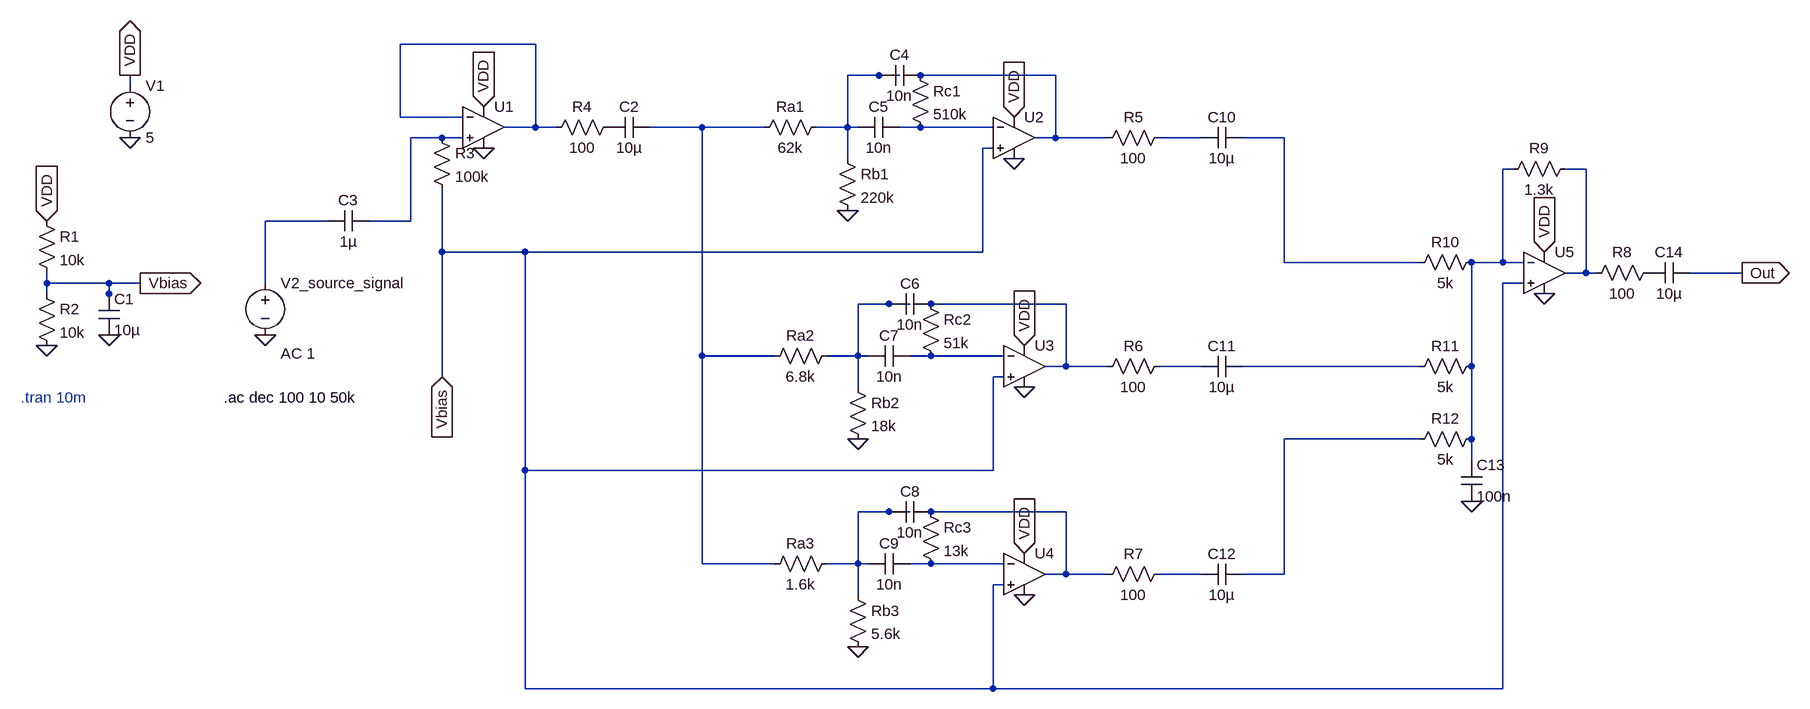
[diagram p0: schematic combined[1].asc]
combined[1].asc, the LTspice schematic file:
Version 4
SHEET 1 2308 1016
WIRE 352 16 144 16
WIRE 880 64 832 64
WIRE 912 64 880 64
WIRE 1152 64 944 64
WIRE -272 80 -272 64
WIRE 144 128 144 16
WIRE 240 128 144 128
WIRE 352 144 352 16
WIRE 352 144 304 144
WIRE 384 144 352 144
WIRE 608 144 528 144
WIRE 704 144 608 144
WIRE 832 144 832 64
WIRE 832 144 784 144
WIRE 848 144 832 144
WIRE 944 144 912 144
WIRE 1056 144 944 144
WIRE 208 160 160 160
WIRE 240 160 208 160
WIRE 1152 160 1152 64
WIRE 1152 160 1120 160
WIRE 1232 160 1152 160
WIRE 1376 160 1312 160
WIRE 1504 160 1440 160
WIRE 1056 176 1040 176
WIRE 832 192 832 144
WIRE 1856 208 1840 208
WIRE 1968 208 1936 208
WIRE 32 288 -64 288
WIRE 160 288 160 160
WIRE 160 288 96 288
WIRE 208 336 208 240
WIRE 336 336 208 336
WIRE 1040 336 1040 176
WIRE 1040 336 336 336
WIRE 1504 352 1504 160
WIRE 1712 352 1504 352
WIRE 1840 352 1840 208
WIRE 1840 352 1792 352
WIRE 1872 352 1840 352
WIRE 1968 368 1968 208
WIRE 1968 368 1936 368
WIRE 1984 368 1968 368
WIRE 2208 368 2128 368
WIRE -400 384 -400 368
WIRE -304 384 -400 384
WIRE -256 384 -304 384
WIRE -64 384 -64 288
WIRE 1872 384 1840 384
WIRE -400 400 -400 384
WIRE -304 400 -304 384
WIRE -304 416 -304 400
WIRE 896 416 848 416
WIRE 928 416 896 416
WIRE 1168 416 960 416
WIRE 608 496 608 144
WIRE 720 496 608 496
WIRE 848 496 848 416
WIRE 848 496 800 496
WIRE 864 496 848 496
WIRE 960 496 928 496
WIRE 1072 496 960 496
WIRE 1168 512 1168 416
WIRE 1168 512 1136 512
WIRE 1232 512 1168 512
WIRE 1376 512 1312 512
WIRE 1712 512 1440 512
WIRE 1792 512 1792 352
WIRE 208 528 208 336
WIRE 1072 528 1056 528
WIRE 848 544 848 496
WIRE 1712 624 1504 624
WIRE 1792 624 1792 512
WIRE 1792 656 1792 624
WIRE 336 672 336 336
WIRE 1056 672 1056 528
WIRE 1056 672 336 672
WIRE 896 736 848 736
WIRE 928 736 896 736
WIRE 1168 736 960 736
WIRE 608 816 608 496
WIRE 720 816 608 816
WIRE 848 816 848 736
WIRE 848 816 800 816
WIRE 864 816 848 816
WIRE 960 816 928 816
WIRE 1072 816 960 816
WIRE 1168 832 1168 736
WIRE 1168 832 1136 832
WIRE 1232 832 1168 832
WIRE 1376 832 1312 832
WIRE 1504 832 1504 624
WIRE 1504 832 1440 832
WIRE 1072 848 1056 848
WIRE 848 864 848 816
WIRE 336 1008 336 672
WIRE 1056 1008 1056 848
WIRE 1056 1008 336 1008
WIRE 1840 1008 1840 384
WIRE 1840 1008 1056 1008
FLAG -272 160 0
FLAG -272 64 VDD
IOPIN -272 64 Out
FLAG -400 480 0
FLAG -400 288 VDD
IOPIN -400 288 In
FLAG 272 112 VDD
IOPIN 272 112 In
FLAG 272 176 0
FLAG -304 464 0
FLAG -256 384 Vbias
IOPIN -256 384 Out
FLAG -64 464 0
FLAG 208 528 Vbias
IOPIN 208 528 In
FLAG 832 272 0
FLAG 1088 192 0
FLAG 1088 128 VDD
IOPIN 1088 128 In
FLAG 848 624 0
FLAG 1104 544 0
FLAG 1104 480 VDD
IOPIN 1104 480 In
FLAG 848 944 0
FLAG 1104 864 0
FLAG 1104 800 VDD
IOPIN 1104 800 In
FLAG 1792 720 0
FLAG 1904 400 0
FLAG 1904 336 VDD
IOPIN 1904 336 In
FLAG 2208 368 Out
IOPIN 2208 368 Out
SYMBOL OpAmps\\UniversalOpAmp 272 144 R0
SYMATTR InstName U1
SYMBOL voltage -272 64 R0
SYMATTR InstName V1
SYMATTR Value 5
SYMBOL res -416 272 R0
SYMATTR InstName R1
SYMATTR Value 10k
SYMBOL res -416 384 R0
SYMATTR InstName R2
SYMATTR Value 10k
SYMBOL cap -320 400 R0
SYMATTR InstName C1
SYMATTR Value 10µ
SYMBOL voltage -64 368 R0
WINDOW 123 24 124 Left 2
WINDOW 39 0 0 Left 0
SYMATTR Value2 AC 1
SYMATTR InstName V2_source_signal
SYMATTR Value ""
SYMBOL cap 96 272 R90
WINDOW 0 0 32 VBottom 2
WINDOW 3 32 32 VTop 2
SYMATTR InstName C3
SYMATTR Value 1µ
SYMBOL res 192 144 R0
SYMATTR InstName R3
SYMATTR Value 100k
SYMBOL res 480 128 R90
WINDOW 0 0 56 VBottom 2
WINDOW 3 32 56 VTop 2
SYMATTR InstName R4
SYMATTR Value 100
SYMBOL cap 528 128 R90
WINDOW 0 0 32 VBottom 2
WINDOW 3 32 32 VTop 2
SYMATTR InstName C2
SYMATTR Value 10µ
SYMBOL OpAmps\\UniversalOpAmp 1088 160 R0
SYMATTR InstName U2
SYMBOL cap 944 48 R90
WINDOW 0 0 32 VBottom 2
WINDOW 3 32 32 VTop 2
SYMATTR InstName C4
SYMATTR Value 10n
SYMBOL cap 912 128 R90
WINDOW 0 0 32 VBottom 2
WINDOW 3 32 32 VTop 2
SYMATTR InstName C5
SYMATTR Value 10n
SYMBOL res 928 48 R0
SYMATTR InstName Rc1
SYMATTR Value 510k
SYMBOL res 816 176 R0
SYMATTR InstName Rb1
SYMATTR Value 220k
SYMBOL res 800 128 R90
WINDOW 0 0 56 VBottom 2
WINDOW 3 32 56 VTop 2
SYMATTR InstName Ra1
SYMATTR Value 62k
SYMBOL OpAmps\\UniversalOpAmp 1104 512 R0
SYMATTR InstName U3
SYMBOL cap 960 400 R90
WINDOW 0 0 32 VBottom 2
WINDOW 3 32 32 VTop 2
SYMATTR InstName C6
SYMATTR Value 10n
SYMBOL cap 928 480 R90
WINDOW 0 0 32 VBottom 2
WINDOW 3 32 32 VTop 2
SYMATTR InstName C7
SYMATTR Value 10n
SYMBOL res 944 400 R0
SYMATTR InstName Rc2
SYMATTR Value 51k
SYMBOL res 832 528 R0
SYMATTR InstName Rb2
SYMATTR Value 18k
SYMBOL res 816 480 R90
WINDOW 0 0 56 VBottom 2
WINDOW 3 32 56 VTop 2
SYMATTR InstName Ra2
SYMATTR Value 6.8k
SYMBOL OpAmps\\UniversalOpAmp 1104 832 R0
SYMATTR InstName U4
SYMBOL cap 960 720 R90
WINDOW 0 0 32 VBottom 2
WINDOW 3 32 32 VTop 2
SYMATTR InstName C8
SYMATTR Value 10n
SYMBOL cap 928 800 R90
WINDOW 0 0 32 VBottom 2
WINDOW 3 32 32 VTop 2
SYMATTR InstName C9
SYMATTR Value 10n
SYMBOL res 944 720 R0
SYMATTR InstName Rc3
SYMATTR Value 13k
SYMBOL res 832 848 R0
SYMATTR InstName Rb3
SYMATTR Value 5.6k
SYMBOL res 816 800 R90
WINDOW 0 0 56 VBottom 2
WINDOW 3 32 56 VTop 2
SYMATTR InstName Ra3
SYMATTR Value 1.6k
SYMBOL res 1328 144 R90
WINDOW 0 0 56 VBottom 2
WINDOW 3 32 56 VTop 2
SYMATTR InstName R5
SYMATTR Value 100
SYMBOL res 1328 496 R90
WINDOW 0 0 56 VBottom 2
WINDOW 3 32 56 VTop 2
SYMATTR InstName R6
SYMATTR Value 100
SYMBOL res 1328 816 R90
WINDOW 0 0 56 VBottom 2
WINDOW 3 32 56 VTop 2
SYMATTR InstName R7
SYMATTR Value 100
SYMBOL cap 1440 144 R90
WINDOW 0 0 32 VBottom 2
WINDOW 3 32 32 VTop 2
SYMATTR InstName C10
SYMATTR Value 10µ
SYMBOL cap 1440 496 R90
WINDOW 0 0 32 VBottom 2
WINDOW 3 32 32 VTop 2
SYMATTR InstName C11
SYMATTR Value 10µ
SYMBOL cap 1440 816 R90
WINDOW 0 0 32 VBottom 2
WINDOW 3 32 32 VTop 2
SYMATTR InstName C12
SYMATTR Value 10µ
SYMBOL res 2080 352 R90
WINDOW 0 0 56 VBottom 2
WINDOW 3 32 56 VTop 2
SYMATTR InstName R8
SYMATTR Value 100
SYMBOL res 1952 192 R90
WINDOW 0 0 56 VBottom 2
WINDOW 3 32 56 VTop 2
SYMATTR InstName R9
SYMATTR Value 1.3k
SYMBOL cap 1776 656 R0
SYMATTR InstName C13
SYMATTR Value 100n
SYMBOL res 1808 336 R90
WINDOW 0 0 56 VBottom 2
WINDOW 3 32 56 VTop 2
SYMATTR InstName R10
SYMATTR Value 5k
SYMBOL res 1808 496 R90
WINDOW 0 0 56 VBottom 2
WINDOW 3 32 56 VTop 2
SYMATTR InstName R11
SYMATTR Value 5k
SYMBOL res 1808 608 R90
WINDOW 0 0 56 VBottom 2
WINDOW 3 32 56 VTop 2
SYMATTR InstName R12
SYMATTR Value 5k
SYMBOL cap 2128 352 R90
WINDOW 0 0 32 VBottom 2
WINDOW 3 32 32 VTop 2
SYMATTR InstName C14
SYMATTR Value 10µ
SYMBOL OpAmps\\UniversalOpAmp 1904 368 R0
SYMATTR InstName U5
TEXT -440 560 Left 2 ;.tran 10m
TEXT -128 560 Left 2 !.ac dec 100 10 50k

The netlist it stands for:
* combined[1].asc
XU1 N006 N001 VDD 0 N001 level1 Avol=1Meg GBW=10Meg Vos=0 En=0 Enk=0 In=0 Ink=0 Rin=500Meg  ; pins In+ In- V+ V- OUT
V1 VDD 0 5
R1 VDD Vbias 10k
R2 Vbias 0 10k
C1 Vbias 0 10µ
V2_source_signal N011 0 AC 1
C3 N006 N011 1µ
R3 N006 Vbias 100k
R4 P001 N001 100
C2 N004 P001 10µ
XU2 Vbias N005 VDD 0 N003 level1 Avol=1Meg GBW=10Meg Vos=0 En=0 Enk=0 In=0 Ink=0 Rin=500Meg  ; pins In+ In- V+ V- OUT
C4 N003 N002 10n
C5 N005 N002 10n
Rc1 N003 N005 510k
Rb1 N002 0 220k
Ra1 N002 N004 62k
XU3 Vbias N014 VDD 0 N013 level1 Avol=1Meg GBW=10Meg Vos=0 En=0 Enk=0 In=0 Ink=0 Rin=500Meg  ; pins In+ In- V+ V- OUT
C6 N013 N012 10n
C7 N014 N012 10n
Rc2 N013 N014 51k
Rb2 N012 0 18k
Ra2 N012 N004 6.8k
XU4 Vbias N020 VDD 0 N019 level1 Avol=1Meg GBW=10Meg Vos=0 En=0 Enk=0 In=0 Ink=0 Rin=500Meg  ; pins In+ In- V+ V- OUT
C8 N019 N018 10n
C9 N020 N018 10n
Rc3 N019 N020 13k
Rb3 N018 0 5.6k
Ra3 N018 N004 1.6k
R5 N007 N003 100
R6 N015 N013 100
R7 N021 N019 100
C10 N008 N007 10µ
C11 N016 N015 10µ
C12 N017 N021 10µ
R8 P002 N010 100
R9 N010 N009 1.3k
C13 N009 0 100n
R10 N009 N008 5k
R11 N009 N016 5k
R12 N009 N017 5k
C14 Out P002 10µ
XU5 Vbias N009 VDD 0 N010 level1 Avol=1Meg GBW=10Meg Vos=0 En=0 Enk=0 In=0 Ink=0 Rin=500Meg  ; pins In+ In- V+ V- OUT
* .tran 10m
.ac dec 100 10 50k
.lib UniversalOpAmp1.lib
.backanno
.end